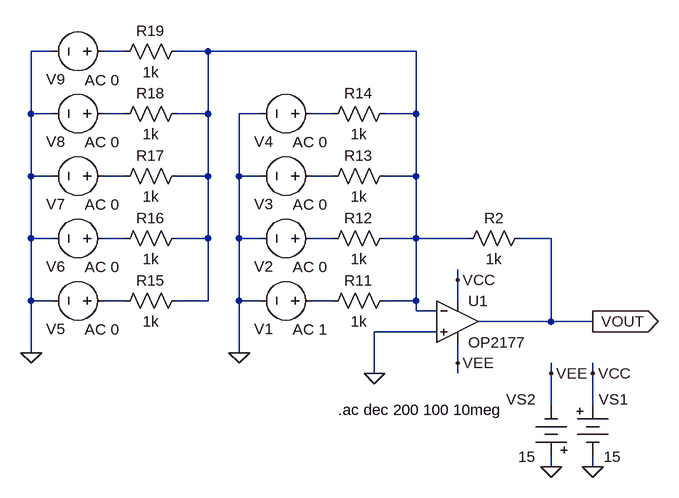
[diagram p0: schematic fig-02-02-26.asc]
fig-02-02-26.asc, the LTspice schematic file:
Version 4
SHEET 1 880 680
WIRE -464 -224 -496 -224
WIRE -352 -224 -384 -224
WIRE -224 -224 -272 -224
WIRE 96 -224 -224 -224
WIRE -496 -128 -496 -224
WIRE -464 -128 -496 -128
WIRE -352 -128 -384 -128
WIRE -224 -128 -224 -224
WIRE -224 -128 -272 -128
WIRE -144 -128 -176 -128
WIRE -32 -128 -64 -128
WIRE 96 -128 96 -224
WIRE 96 -128 48 -128
WIRE -496 -32 -496 -128
WIRE -464 -32 -496 -32
WIRE -352 -32 -384 -32
WIRE -224 -32 -224 -128
WIRE -224 -32 -272 -32
WIRE -176 -32 -176 -128
WIRE -144 -32 -176 -32
WIRE -32 -32 -64 -32
WIRE 96 -32 96 -128
WIRE 96 -32 48 -32
WIRE -496 64 -496 -32
WIRE -464 64 -496 64
WIRE -352 64 -384 64
WIRE -224 64 -224 -32
WIRE -224 64 -272 64
WIRE -176 64 -176 -32
WIRE -144 64 -176 64
WIRE -32 64 -64 64
WIRE 96 64 96 -32
WIRE 96 64 48 64
WIRE 176 64 96 64
WIRE 304 64 256 64
WIRE 160 128 160 112
WIRE -496 160 -496 64
WIRE -464 160 -496 160
WIRE -352 160 -384 160
WIRE -224 160 -224 64
WIRE -224 160 -272 160
WIRE -176 160 -176 64
WIRE -144 160 -176 160
WIRE -32 160 -64 160
WIRE 96 160 96 64
WIRE 96 160 48 160
WIRE 160 160 160 128
WIRE 96 176 96 160
WIRE 128 176 96 176
WIRE 304 192 304 64
WIRE 304 192 192 192
WIRE 368 192 304 192
WIRE 128 208 32 208
WIRE -496 240 -496 160
WIRE -176 240 -176 160
WIRE 160 256 160 224
WIRE 32 272 32 208
WIRE 160 272 160 256
WIRE 304 272 304 256
WIRE 368 272 368 256
WIRE 304 320 304 272
WIRE 368 320 368 272
WIRE 304 416 304 400
WIRE 368 416 368 400
FLAG 32 272 0
FLAG 368 192 VOUT
IOPIN 368 192 Out
FLAG 304 416 0
FLAG 368 416 0
FLAG 304 272 VEE
FLAG 368 272 VCC
FLAG 160 128 VCC
FLAG 160 256 VEE
FLAG -176 240 0
FLAG -496 240 0
SYMBOL voltage -48 64 R90
WINDOW 3 -87 181 Left 2
WINDOW 123 44 46 VLeft 2
WINDOW 39 0 0 Left 2
WINDOW 0 43 105 VLeft 2
SYMATTR Value ""
SYMATTR Value2 AC 0
SYMATTR InstName V2
SYMBOL OP2177 160 128 R0
SYMATTR InstName U1
SYMBOL res 272 48 R90
WINDOW 0 0 56 VBottom 2
WINDOW 3 32 56 VTop 2
SYMATTR InstName R2
SYMATTR Value 1k
SYMBOL res 64 48 R90
WINDOW 0 0 56 VBottom 2
WINDOW 3 32 56 VTop 2
SYMATTR InstName R12
SYMATTR Value 1k
SYMBOL Misc\\battery 368 304 R0
WINDOW 0 9 8 Left 2
WINDOW 3 17 96 Left 2
WINDOW 123 0 0 Left 0
WINDOW 39 0 0 Left 0
SYMATTR InstName VS1
SYMATTR Value 15
SYMBOL Misc\\battery 304 416 R180
WINDOW 0 24 104 Left 2
WINDOW 3 24 16 Left 2
WINDOW 123 0 0 Left 0
WINDOW 39 0 0 Left 0
SYMATTR InstName VS2
SYMATTR Value 15
SYMBOL voltage -48 160 R90
WINDOW 3 -87 181 Left 2
WINDOW 123 44 46 VLeft 2
WINDOW 39 0 0 Left 2
WINDOW 0 43 105 VLeft 2
SYMATTR Value ""
SYMATTR Value2 AC 1
SYMATTR InstName V1
SYMBOL res 64 144 R90
WINDOW 0 0 56 VBottom 2
WINDOW 3 32 56 VTop 2
SYMATTR InstName R11
SYMATTR Value 1k
SYMBOL voltage -48 -32 R90
WINDOW 3 -87 181 Left 2
WINDOW 123 44 46 VLeft 2
WINDOW 39 0 0 Left 2
WINDOW 0 43 105 VLeft 2
SYMATTR Value ""
SYMATTR Value2 AC 0
SYMATTR InstName V3
SYMBOL res 64 -48 R90
WINDOW 0 0 56 VBottom 2
WINDOW 3 32 56 VTop 2
SYMATTR InstName R13
SYMATTR Value 1k
SYMBOL voltage -48 -128 R90
WINDOW 3 -87 181 Left 2
WINDOW 123 44 46 VLeft 2
WINDOW 39 0 0 Left 2
WINDOW 0 43 105 VLeft 2
SYMATTR Value ""
SYMATTR Value2 AC 0
SYMATTR InstName V4
SYMBOL res 64 -144 R90
WINDOW 0 0 56 VBottom 2
WINDOW 3 32 56 VTop 2
SYMATTR InstName R14
SYMATTR Value 1k
SYMBOL voltage -368 64 R90
WINDOW 3 -87 181 Left 2
WINDOW 123 44 46 VLeft 2
WINDOW 39 0 0 Left 2
WINDOW 0 43 105 VLeft 2
SYMATTR Value ""
SYMATTR Value2 AC 0
SYMATTR InstName V6
SYMBOL res -256 48 R90
WINDOW 0 0 56 VBottom 2
WINDOW 3 32 56 VTop 2
SYMATTR InstName R16
SYMATTR Value 1k
SYMBOL voltage -368 160 R90
WINDOW 3 -87 181 Left 2
WINDOW 123 44 46 VLeft 2
WINDOW 39 0 0 Left 2
WINDOW 0 43 105 VLeft 2
SYMATTR Value ""
SYMATTR Value2 AC 0
SYMATTR InstName V5
SYMBOL res -256 144 R90
WINDOW 0 0 56 VBottom 2
WINDOW 3 32 56 VTop 2
SYMATTR InstName R15
SYMATTR Value 1k
SYMBOL voltage -368 -32 R90
WINDOW 3 -87 181 Left 2
WINDOW 123 44 46 VLeft 2
WINDOW 39 0 0 Left 2
WINDOW 0 43 105 VLeft 2
SYMATTR Value ""
SYMATTR Value2 AC 0
SYMATTR InstName V7
SYMBOL res -256 -48 R90
WINDOW 0 0 56 VBottom 2
WINDOW 3 32 56 VTop 2
SYMATTR InstName R17
SYMATTR Value 1k
SYMBOL voltage -368 -128 R90
WINDOW 3 -87 181 Left 2
WINDOW 123 44 46 VLeft 2
WINDOW 39 0 0 Left 2
WINDOW 0 43 105 VLeft 2
SYMATTR Value ""
SYMATTR Value2 AC 0
SYMATTR InstName V8
SYMBOL res -256 -144 R90
WINDOW 0 0 56 VBottom 2
WINDOW 3 32 56 VTop 2
SYMATTR InstName R18
SYMATTR Value 1k
SYMBOL voltage -368 -224 R90
WINDOW 3 -87 181 Left 2
WINDOW 123 44 46 VLeft 2
WINDOW 39 0 0 Left 2
WINDOW 0 43 105 VLeft 2
SYMATTR Value ""
SYMATTR Value2 AC 0
SYMATTR InstName V9
SYMBOL res -256 -240 R90
WINDOW 0 0 56 VBottom 2
WINDOW 3 32 56 VTop 2
SYMATTR InstName R19
SYMATTR Value 1k
TEXT -24 328 Left 2 !.ac dec 200 100 10meg

The netlist it stands for:
* fig-02-02-26.asc
V2 N008 0 AC 0
* U1: OP2177 (symbol OP2177 not available, pins judged from their places): In+=0 In-=N002 V+=VCC V-=VEE OUT=VOUT
R2 VOUT N002 1k
R12 N002 N008 1k
VS1 VCC 0 15
VS2 0 VEE 15
V1 N010 0 AC 1
R11 N002 N010 1k
V3 N006 0 AC 0
R13 N002 N006 1k
V4 N004 0 AC 0
R14 N002 N004 1k
V6 N007 0 AC 0
R16 N002 N007 1k
V5 N009 0 AC 0
R15 N002 N009 1k
V7 N005 0 AC 0
R17 N002 N005 1k
V8 N003 0 AC 0
R18 N002 N003 1k
V9 N001 0 AC 0
R19 N002 N001 1k
.ac dec 200 100 10meg
.backanno
.end